# EAGLE design monostable (EAGLE 7.2.0)
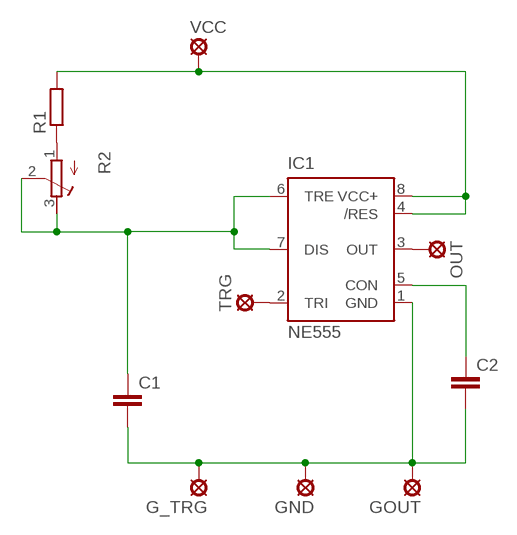
[diagram p0: schematic, sheet 1]

## Parts
C1  C-EU050-024X044  [C050-024X044]
C2  C-EU050-024X044  [C050-024X044]
G_TRG  LSP10  [LSP10]
GND  LSP10  [LSP10]
GOUT  LSP10  [LSP10]
IC1  NE555  [DIL-08]
OUT  LSP10  [LSP10]
R1  R-EU_0207/10  [0207/10]
R2  R-TRIMM3339P  [RTRIM3339P]
TRG  LSP10  [LSP10]
VCC  LSP10  [LSP10]

## Nets
N$1: C1.2 C2.2 G_TRG.MP GND.MP GOUT.MP IC1.1(GND)
N$2: C1.1 IC1.6(TRE) IC1.7(DIS) R2.2(S) R2.3(E)
N$3: C2.1 IC1.5(CON)
N$4: IC1.4(/RES) IC1.8(VCC+) R1.2 VCC.MP
N$5: IC1.2(TRI) TRG.MP
N$6: IC1.3(OUT) OUT.MP
N$7: R1.1 R2.1(A)

## Library data of the parts
C1 C2 = rcl:C-EU: CAPACITOR, European symbol
G_TRG GND GOUT OUT TRG VCC = solpad:LSP10: SOLDER PAD drill 1.0 mm, distributor Buerklin, 12H555
IC1 = st-microelectronics:NE555: General purpose bipolar Timer; MF: Arrow Electronics; MPN: NE555N; OC_FARNELL: 1467742; OC_NEWARK: 89K1486
R1 = resistor:R-EU_: RESISTOR, European symbol
R2 = rcl:R-TRIMM: Trimm resistor

## Board
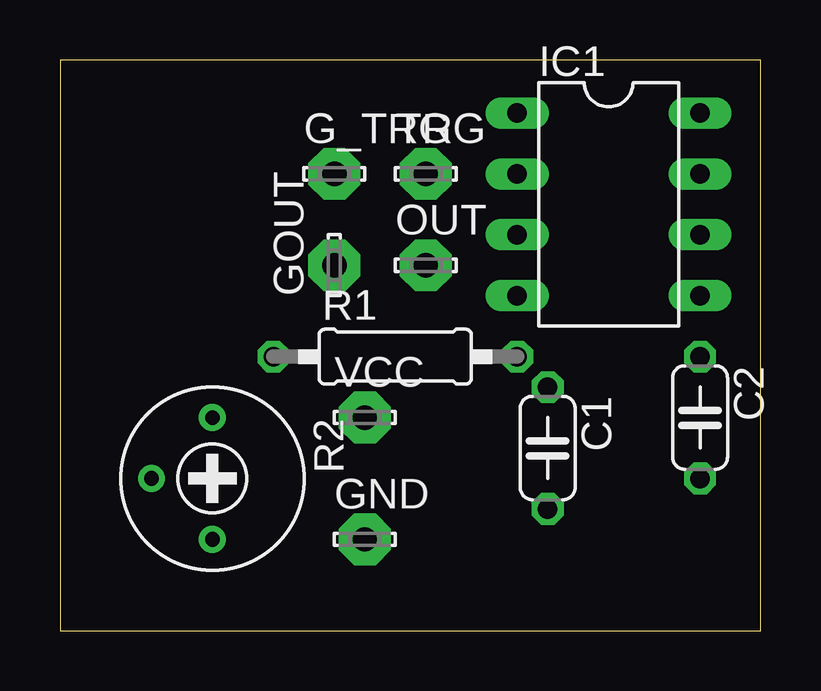
[diagram p1: board, top side]
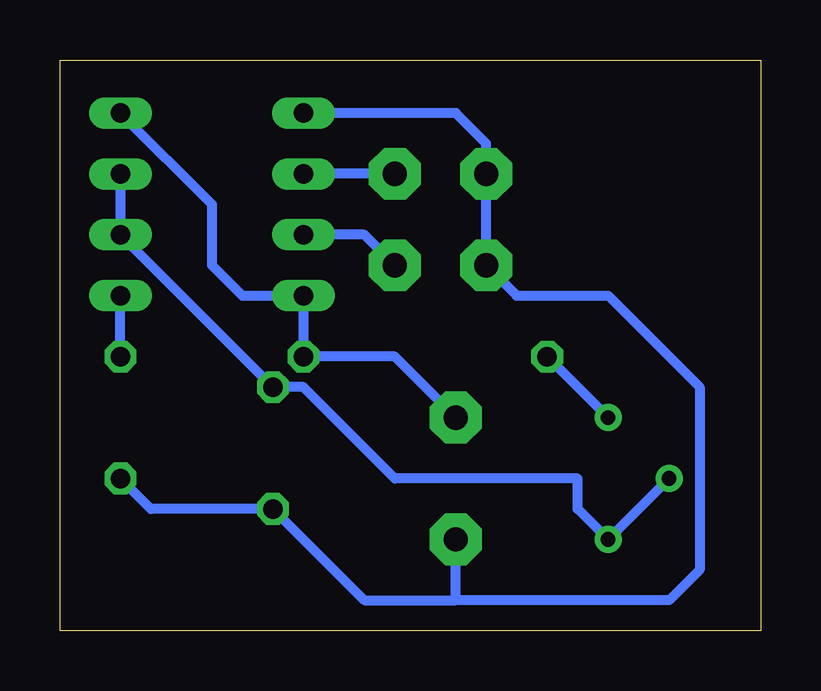
[diagram p2: board, bottom side, seen from below]

Size 29.19 x 23.8 mm. Coordinates in mm from the lower left corner, seen from the top.
Outline: 0,0 29.19,0 29.19,23.8 0,23.8 0,0
Copper layers (1*16): Top 0.035mm / dielectric 1.5mm / Bottom 0.035mm
Design rules "default": minimum track width 10mil, minimum drill 24mil, track to track 8mil, track to pad 8mil, pad to pad 8mil, via to via 8mil, smd to smd 8mil, copper to edge 40mil, drill to drill 8mil, minimum pad ring 10mil, minimum via ring 8mil, stop-mask expansion 4mil, vias tented up to drill 0mil, thermal gap 10mil

### Footprints (pad centres in the part's own frame; a part is rotated, then mirrored left to right if it is on the bottom)
C050-024X044 = drill 0.813 octagon: 1 -2.54,0; 2 2.54,0
LSP10 = drill 1.016 pad 2.159 octagon: MP 0,0
DIL-08 = drill 0.813 long: 1 -3.81,-3.81; 2 -1.27,-3.81; 3 1.27,-3.81; 4 3.81,-3.81; 5 3.81,3.81; 6 1.27,3.81; 7 -1.27,3.81; 8 -3.81,3.81
0207/10 = drill 0.813 octagon: 1 -5.08,0; 2 5.08,0
RTRIM3339P = drill 0.61: 1 -2.54,0; 2 0,-2.54; 3 2.54,0

### Placement (x,y rotation side)
C1  20.32,7.62 270 top
C2  26.67,8.89 270 top
G_TRG  11.43,19.05 0 top
GND  12.7,3.81 0 top
GOUT  11.43,15.24 90 top
IC1  22.86,17.78 270 top
OUT  15.24,15.24 0 top
R1  13.97,11.43 0 top
R2  6.35,6.35 270 top
TRG  15.24,19.05 0 top
VCC  12.7,8.89 0 top

### Tracks (layer width: path | path; a pad name or v marks a point on that pad's centre or on a via)
N$1
  Bottom 0.406: IC1.1 12.7,21.59 11.43,20.32 G_TRG.MP GOUT.MP 10.16,13.97 6.35,13.97 2.54,10.16 2.54,2.54 3.81,1.27 12.7,1.27 | 12.7,1.27 GND.MP | 12.7,1.27 16.51,1.27 C1.2 25.4,5.08 C2.2
N$2
  Bottom 0.406: IC1.7 IC1.6 C1.1 19.05,10.16 15.24,6.35 7.62,6.35 7.62,5.08 R2.3 R2.2
N$3
  Bottom 0.406: C2.1 IC1.5
N$4
  Bottom 0.406: IC1.8 22.86,17.78 22.86,15.24 21.59,13.97 IC1.4 R1.2 15.24,11.43 VCC.MP
N$5
  Bottom 0.406: TRG.MP IC1.2
N$6
  Bottom 0.406: OUT.MP 16.51,16.51 IC1.3
N$7
  Bottom 0.406: R2.1 R1.1